# Altium schematic sheet STSPIN32F0A-bldc-driver.SchDoc: STSPIN32F0A-BLDC-Driver-Sch
size A3; DocumentNumber: 3; SheetNumber: 3; SheetTotal: 8
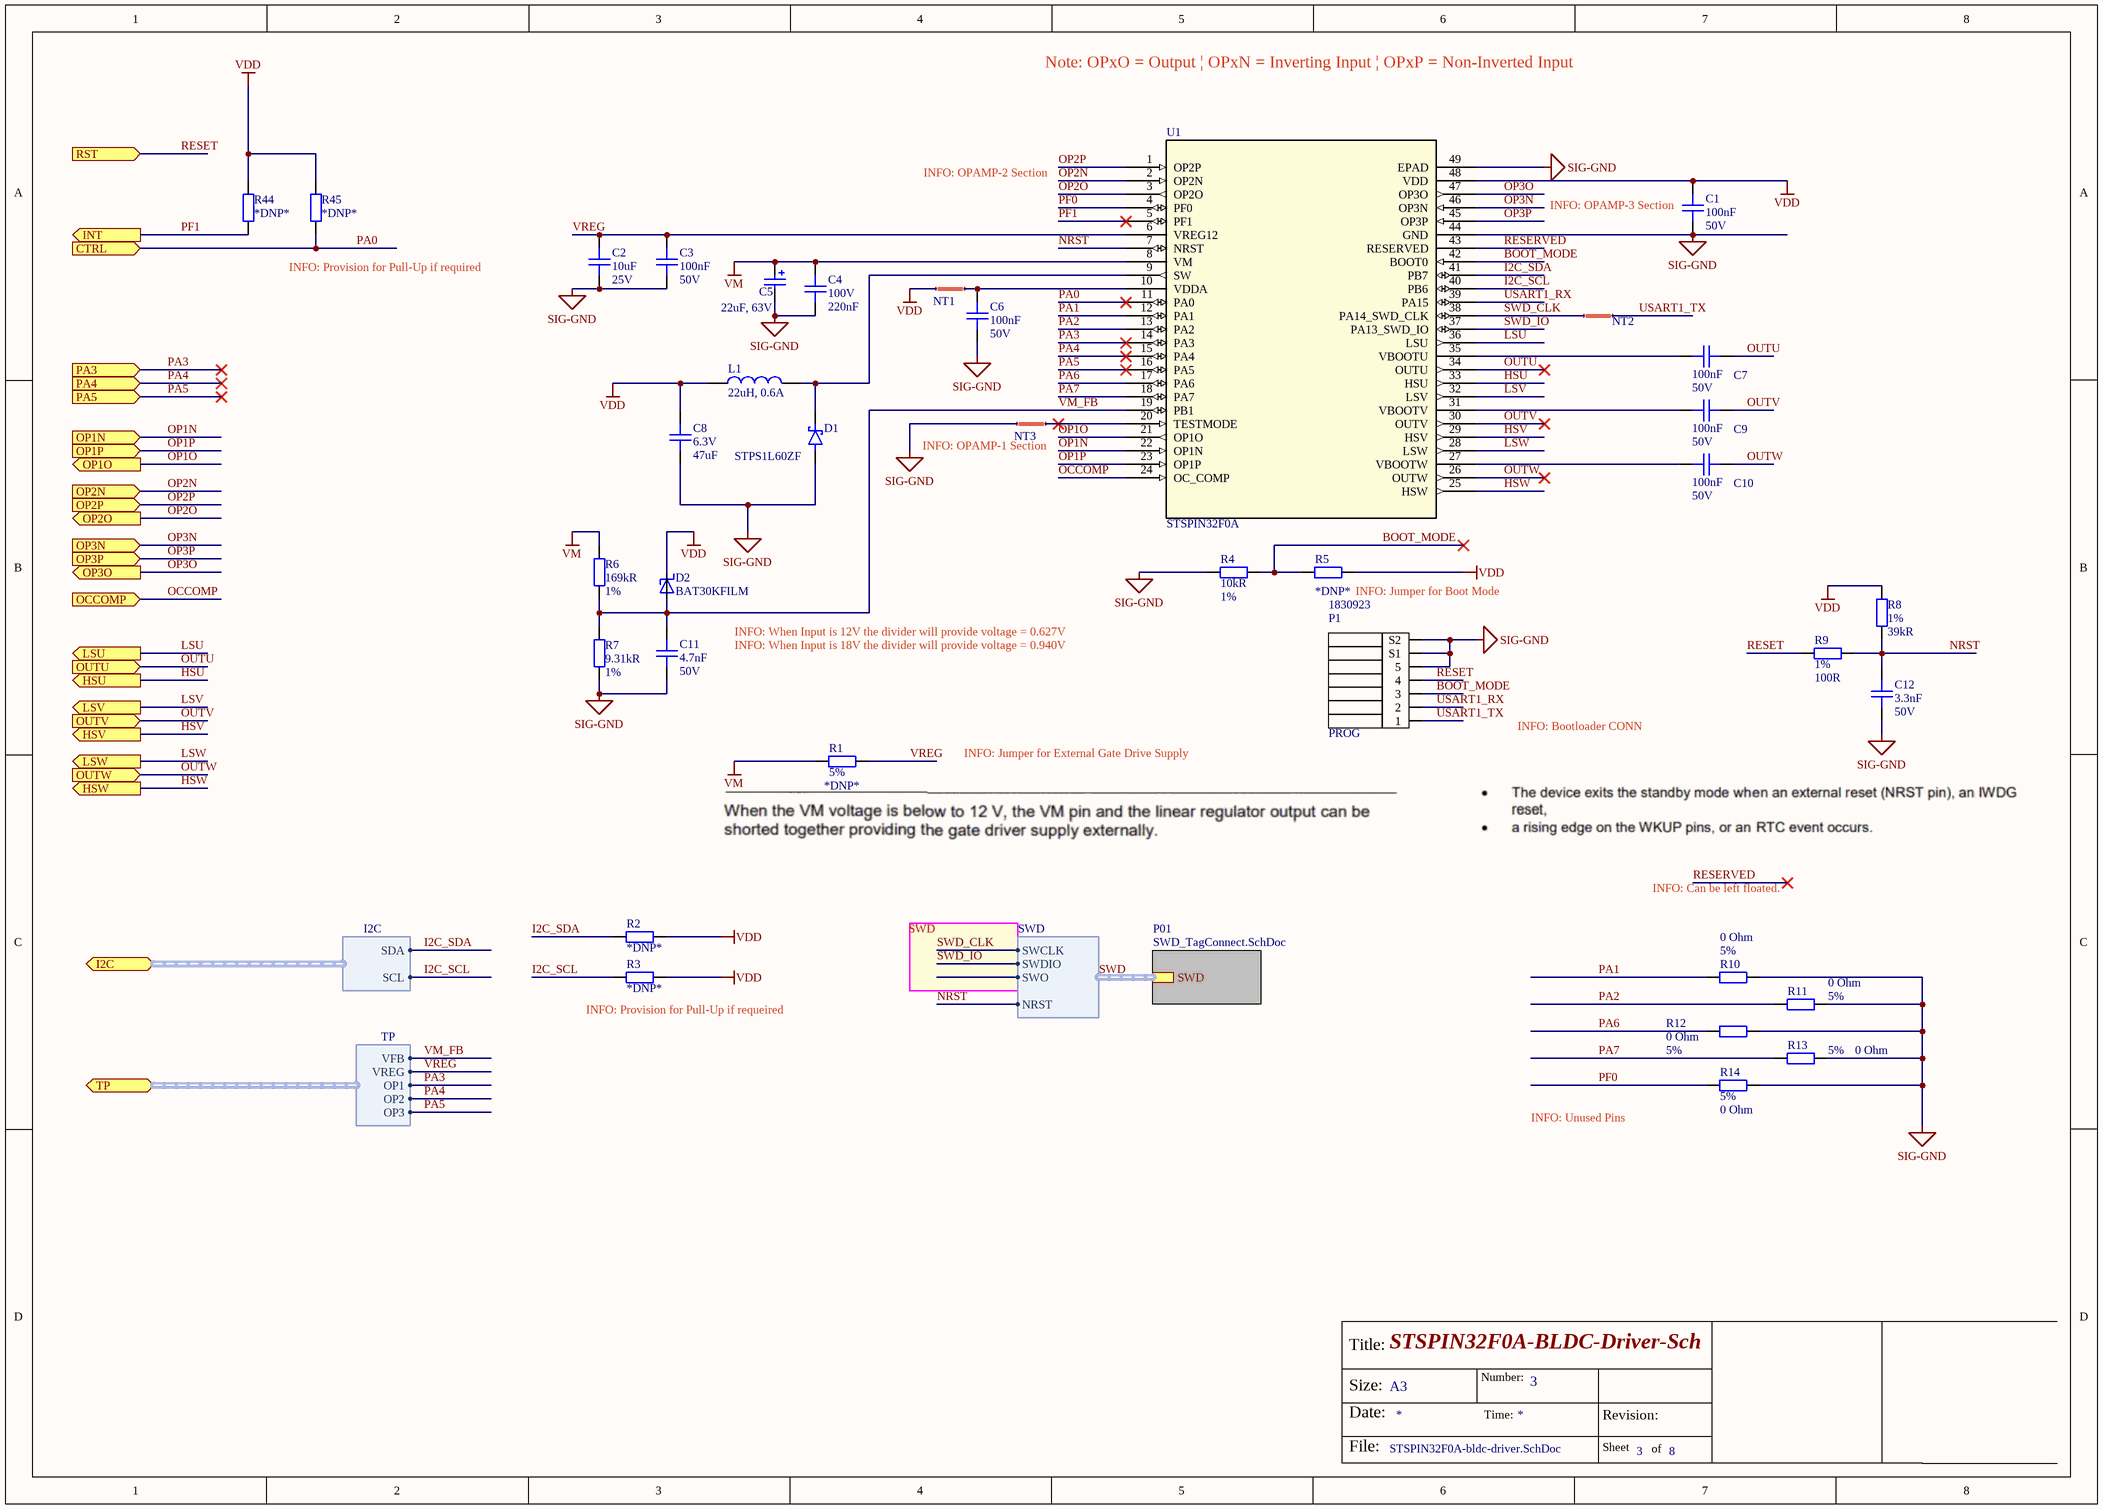
[diagram p0: STSPIN32F0A-bldc-driver.SchDoc]

## Parts
C1  Capacitance: 100nF  Voltage: 50V  [C0402]  (hidden comment: CAP CER 0.1UF 50V X7R 0402)
C2  Capacitance: 10uF  Voltage Rating: 25V  [C1206]  (hidden comment: CAP CER 10UF 25V X7R 1206)
C3  Capacitance: 100nF  Voltage: 50V  [C0402]  (hidden comment: CAP CER 0.1UF 50V X7R 0402)
C4  Voltage Rating: 100V  Capacitance: 220nF  [C0805]  (hidden comment: CAP CER 220nF 100V X7R 0805)
C5  22uF, 63V  [WCAP-ASLL_D6.3H7.7]
C6  Capacitance: 100nF  Voltage: 50V  [C0402]  (hidden comment: CAP CER 0.1UF 50V X7R 0402)
C7  Capacitance: 100nF  Voltage: 50V  [C0402]  (hidden comment: CAP CER 0.1UF 50V X7R 0402)
C8  Voltage Rating: 6.3V  Capacitance: 47uF  [C0603]  (hidden comment: CAP CER 47UF 6.3V X5R 0603)
C9  Capacitance: 100nF  Voltage: 50V  [C0402]  (hidden comment: CAP CER 0.1UF 50V X7R 0402)
C10  Capacitance: 100nF  Voltage: 50V  [C0402]  (hidden comment: CAP CER 0.1UF 50V X7R 0402)
C11  Capacitance: 4.7nF  Voltage Rating: 50V  [C0402]  (hidden comment: CAP CER 4.7nF 50V X7R 0402)
C12  Capacitance: 3.3nF  Voltage: 50V  [C0402]  (hidden comment: CAP CER 0.1UF 50V X7R 0402)
D1  STPS1L60ZF  [DIO_STPS1L60ZF]
D2  BAT30KFILM  [SOD523]
L1  22uH, 0.6A  [WE-LQS_3015]
NT1  Net Tie  [Net Tie 6x30mil]  (value not drawn)  (net tie, no BOM)
NT2  Net Tie  [Net Tie 6x30mil]  (value not drawn)  (net tie, no BOM)
NT3  Net Tie  [Net Tie 6x30mil]  (value not drawn)  (net tie, no BOM)
P1  PROG  Supplier Part Number 1: 1830923  [JST_S5B-ZR-SM4A-TF(LF)(SN)]
R1  *DNP*  Tolerance: 5%  [R0402]
R2  Resistance: *DNP*  [R0402]  (hidden comment: RES SMD 4.75K OHM 1% 1/16W 0402)
R3  Resistance: *DNP*  [R0402]  (hidden comment: RES SMD 4.75K OHM 1% 1/16W 0402)
R4  Resistance: 10kR  Tolerance: 1%  [R0402]  (hidden comment: RES SMD 10K OHM 1% 1/16W 0402)
R5  *DNP*  [R0402]
R6  Resistance: 169kR  Tolerance: 1%  [R0603]  (hidden comment: RES SMD 169 KOHM 1% 1/8W 0603)
R7  Resistance: 9.31kR  Tolerance: 1%  [R0603]  (hidden comment: RES SMD 9.31 KOHM 1% 1/8W 0603)
R8  Tolerance: 1%  Resistance: 39kR  [R0402]  (hidden comment: RES SMD 39K OHM 1% 1/10W 0402)
R9  Tolerance: 1%  Resistance: 100R  [R0402]  (hidden comment: RES SMD 100 OHM 1% 1/16W 0402)
R10  Tolerance: 5%  Resistance: 0 Ohm  [R0402]  (hidden comment: RES SMD 0 OHM JUMPER 1/16W 0402)
R11  Tolerance: 5%  Resistance: 0 Ohm  [R0402]  (hidden comment: RES SMD 0 OHM JUMPER 1/16W 0402)
R12  Tolerance: 5%  Resistance: 0 Ohm  [R0402]  (hidden comment: RES SMD 0 OHM JUMPER 1/16W 0402)
R13  Tolerance: 5%  Resistance: 0 Ohm  [R0402]  (hidden comment: RES SMD 0 OHM JUMPER 1/16W 0402)
R14  Tolerance: 5%  Resistance: 0 Ohm  [R0402]  (hidden comment: RES SMD 0 OHM JUMPER 1/16W 0402)
R44  *DNP*  [R0402]
R45  *DNP*  [R0402]
U1  STSPIN32F0A  [VFQFPN-48_7x7x1mm_STM]

## Sub-sheets
P01 = SWD_TagConnect.SchDoc: SWD (harness SWD)  | Caption: SWD

## Ports
CTRL (in), HSU (out), HSV (out), HSW (out), I2C (bidir, harness I2C), INT (out), LSU (out), LSV (out), LSW (out), OCCOMP (in), OP1N (in), OP1O (out), OP1P (in), OP2N (in), OP2O (out), OP2P (in), OP3N (in), OP3O (out), OP3P (in), OUTU (in), OUTV (in), OUTW (in), PA3 (in), PA4 (in), PA5 (in), RST (in), TP (bidir, harness TP)

## Harnesses
SWD: SWDIO, SWCLK, NRST, SWO
I2C: SDA, SCL
TP: VFB, VREG, OP1, OP2, OP3

## Nets
SIG-GND: C1.1 C2.1 C3.1 C4.1 C5.2(N) C6.1 C8.1 C11.1 C12.1 D1.2(A) NT3.1 P1.5 P1.S1 P1.S2 R4.2 R7.1 R10.2 R11.2 R12.2 R13.2 R14.2 U1.44(GND) U1.49(EPAD)
VDD: C1.2 C8.2 D2.1(K) L1.1 NT1.1 R2.2 R3.2 R5.2 R8.2 R44.2 R45.2 U1.48(VDD)
VM: C4.2 C5.1(P) R1.1 R6.2 U1.8(VM)
BOOT_MODE: P1.3 R4.1 R5.1 U1.42(BOOT0)
HSU: U1.33(HSU) ; port HSU
HSV: U1.29(HSV) ; port HSV
HSW: U1.25(HSW) ; port HSW
I2C_SCL: R3.1 U1.40(PB6) ; port I2C.SCL
I2C_SDA: R2.1 U1.41(PB7) ; port I2C.SDA
LSU: U1.36(LSU) ; port LSU
LSV: U1.32(LSV) ; port LSV
LSW: U1.28(LSW) ; port LSW
NRST: C12.2 R8.1 R9.1 U1.7(NRST) ; sheet P01/SWD.NRST
OCCOMP: U1.24(OC_COMP) ; port OCCOMP
OP1N: U1.22(OP1N) ; port OP1N
OP1O: U1.21(OP1O) ; port OP1O
OP1P: U1.23(OP1P) ; port OP1P
OP2N: U1.2(OP2N) ; port OP2N
OP2O: U1.3(OP2O) ; port OP2O
OP2P: U1.1(OP2P) ; port OP2P
OP3N: U1.46(OP3N) ; port OP3N
OP3O: U1.47(OP3O) ; port OP3O
OP3P: U1.45(OP3P) ; port OP3P
OUTU: C7.2 U1.34(OUTU) ; port OUTU
OUTV: C9.1 U1.30(OUTV) ; port OUTV
OUTW: C10.1 U1.26(OUTW) ; port OUTW
PA0: R45.1 U1.11(PA0) ; port CTRL
PA1: R10.1 U1.12(PA1)
PA2: R11.1 U1.13(PA2)
PA3: U1.14(PA3) ; port PA3, port TP.OP1
PA4: U1.15(PA4) ; port PA4, port TP.OP2
PA5: U1.16(PA5) ; port PA5, port TP.OP3
PA6: R12.1 U1.17(PA6)
PA7: R13.1 U1.18(PA7)
PF0: R14.1 U1.4(PF0)
PF1: R44.1 U1.5(PF1) ; port INT
RESERVED: U1.43(RESERVED)
RESET: P1.4 R9.2 ; port RST
SWD_CLK: NT2.1 U1.38(PA14_SWD_CLK) ; sheet P01/SWD.SWCLK  [project net SWD.SWCLK]
SWD_IO: U1.37(PA13_SWD_IO) ; sheet P01/SWD.SWDIO  [project net SWD.SWDIO]
USART1_RX: P1.2 U1.39(PA15)
USART1_TX: NT2.2 P1.1
VM_FB: C11.2 D2.2(A) R6.1 R7.2 U1.19(PB1) ; port TP.VFB
VREG: C2.2 C3.2 R1.2 U1.6(VREG12) ; port TP.VREG
NetC6_2: C6.2 NT1.2 U1.10(VDDA)
NetC7_1: C7.1 U1.35(VBOOTU)
NetC9_2: C9.2 U1.31(VBOOTV)
NetC10_2: C10.2 U1.27(VBOOTW)
NetD1_1: D1.1(K) L1.2 U1.9(SW)
NetNT3_2: NT3.2 U1.20(TESTMODE)

## Buses and harness runs
harness SWD = sheet P01/SWD

## Notes on the sheet
- Note: OPxO = Output | OPxN = Inverting Input | OPxP = Non-Inverted Input
- INFO: OPAMP-2 Section
- (near C1) INFO: OPAMP-3 Section
- INFO: Provision for Pull-Up if required
- (near NT3) INFO: OPAMP-1 Section
- INFO: When Input is 12V the divider will provide voltage = 0.627V
- INFO: When Input is 18V the divider will provide voltage = 0.940V
- (near R5) INFO: Jumper for Boot Mode
- INFO: Jumper for External Gate Drive Supply
- INFO: Bootloader CONN
- INFO: Can be left floated.
- SWD
- (near R3) INFO: Provision for Pull-Up if requeired
- INFO: Unused Pins
- Title:
- Size:
- A3
- Number:
- Date:
- File:
- Time:
- Revision:
- Sheet
- of

## Library data of the parts
C1 C3 C6 C7 C9 C10 = CAP CER 0.1UF 50V X7R 0402: 0.1µF ±10% 50V Ceramic Capacitor X7R 0402 (1005 Metric); Manufacturer: TDK; Manufacturer Part Number: CGA2B3X7R1H104K050BB; Supplier 1: Digi-Key; Stock 1: 2925303; Pricing 1: 1=0.17, 10=0.118, 50=0.0668, 100=0.0553, 500=0.0388, 1000=0.0321, 2500=0.0299, 5000=0.0273 (USD); Mount: Surface Mount; Case/Package: 0402; Weight: 2.3E-05oz; Case Code (Metric): 1005; Case Code (Imperial): 0402; Min Operating Temperature: -55°C; Max Operating Temperature: 125°C; Voltage Rating: 50V; Tolerance: 10%; Packaging: Tape and Reel; Package Quantity: 1; Voltage Rating (DC): 50V; Dielectric: X7R; Termination: SMD/SMT; Composition: Ceramic; Length: 1mm; Height: 0.5mm; Width: 0.02inch; Thickness: 0.022inch; Depth: 0.5mm; Ratings: AEC-Q200; REACH SVHC: No SVHC; Lead Free: Lead Free; ComponentLink1URL: http://product.tdk.com/capacitor/mlcc/en/documents/mlccspec_automotive_general_midvoltage_en.pdf?src-supplier=Future+Electronics; ComponentLink1Description: http://product.tdk.com/capacitor/mlcc/en/documents/mlccspec_automotive_general_midvoltage_en.pdf?src-supplier=Future+Electronics; ComponentLink2URL: http://www.farnell.com/datasheets/1807242.pdf?src-supplier=Element14; ComponentLink2Description: http://www.farnell.com/datasheets/1807242.pdf?src-supplier=Element14; ComponentLink3URL: http://www.mouser.com/ds/2/400/lcc_automotive_general_en-843974.pdf?src-supplier=Mouser; ComponentLink3Description: http://www.mouser.com/ds/2/400/lcc_automotive_general_en-843974.pdf?src-supplier=Mouser; ComponentLink4URL: http://www.farnell.com/datasheets/1936565.pdf?src-supplier=Element14; ComponentLink4Description: http://www.farnell.com/datasheets/1936565.pdf?src-supplier=Element14; ComponentLink5URL: http://www.farnell.com/datasheets/1735392.pdf?src-supplier=Element14; ComponentLink5Description: http://www.farnell.com/datasheets/1735392.pdf?src-supplier=Element14; Supplier Part Number 1: 445-6899-1-ND
C2 = CAP CER 10UF 25V X7R 1206: 10µF ±10% 25V Ceramic Capacitor X7R 1206 (3216 Metric); Manufacturer: Yageo; Manufacturer Part Number: CC1206KKX7R8BB106; Supplier 1: Digi-Key; Stock 1: 3990; Pricing 1: 1=0.49, 10=0.348, 50=0.2632, 100=0.2293, 500=0.1698, 1000=0.1444 (USD); Mount: Surface Mount; Case/Package: 1206; Weight: 0.000571oz; Case Code (Imperial): 1206; Case Code (Metric): 3216; Min Operating Temperature: -55°C; Max Operating Temperature: 125°C; Tolerance: 10%; Packaging: Tape and Reel; Voltage Rating (DC): 25V; Dielectric: X7R; Termination: SMD/SMT; Composition: Ceramic; Length: 3.2mm; Width: 1.6mm; Thickness: 0.071inch; Depth: 1.6mm; Radiation Hardening: No; Lead Free: Lead Free; Halogen Free: Halogen Free; ComponentLink1URL: http://www.yageo.com/documents/recent/UPY-GPHC_X7R_6.3V-to-50V_8.pdf?src-supplier=Avnet; ComponentLink1Description: http://www.yageo.com/documents/recent/UPY-GPHC_X7R_6.3V-to-50V_8.pdf?src-supplier=Avnet; ComponentLink2URL: http://www.mouser.com/ds/2/447/Yageo_UPY-GP_NP0_16V-to-50V_9-358835.pdf?src-supplier=Mouser; ComponentLink2Description: http://www.mouser.com/ds/2/447/Yageo_UPY-GP_NP0_16V-to-50V_9-358835.pdf?src-supplier=Mouser; ComponentLink3URL: http://components.arrow.com/part/dataview/0323_04166677?src-supplier=Arrow+Europe; ComponentLink3Description: http://components.arrow.com/part/dataview/0323_04166677?src-supplier=Arrow+Europe; ComponentLink4URL: http://www.yageo.com/documents/recent/UPY-GPHC_X7R_6.3V-to-50V_18.pdf?src-supplier=Digi-Key; ComponentLink4Description: http://www.yageo.com/documents/recent/UPY-GPHC_X7R_6.3V-to-50V_18.pdf?src-supplier=Digi-Key; ComponentLink5URL: http://www.yageo.com/documents/recent/UPY-GPHC_X7R_6.3V-to-50V_9.pdf?src-supplier=Future+Electronics; ComponentLink5Description: http://www.yageo.com/documents/recent/UPY-GPHC_X7R_6.3V-to-50V_9.pdf?src-supplier=Future+Electronics; Supplier Part Number 1: 311-1959-1-ND
C4 = CAP CER 22UF 10V X5R 0805: 220nF ±10% 100V Ceramic Capacitor X7R 0805 (2012 Metric); Manufacturer: KEMET; Manufacturer Part Number: C0805C224K1RECAUTO; Stock 1: 1006805; Pricing 1: 1=0.45, 10=0.312, 100=0.1875, 500=0.1406, 1000=0.1187 (USD); Mount: Surface Mount; Number of Pins: 2; Case Code (Metric): 2012; Case Code (Imperial): 0805; Min Operating Temperature: -55°C; Max Operating Temperature: 85°C; Packaging: Tape and Reel; Tolerance: 10%; Voltage Rating (DC): 100V; Dielectric: X7R; Termination: SMD/SMT; Package Quantity: 1; Composition: Ceramic; Length: 2mm; Height: 1.25mm; Width: 0.049inch; Thickness: 0.053inch; Depth: 1.25mm; Radiation Hardening: No; REACH SVHC: Unknown; Case/Package: 0805; Datasheet: https://content.kemet.com/datasheets/KEM_C1090_X7R_ESD.pdf; Supplier 1: Digi-Key; Supplier Part Number 1: 399-17890-1-ND
C5 = 865060745003: WCAP-ASLL Aluminum Electrolytic Capacitor, V-Chip, SMT, D6.3xH7.7mm, 22uF, 63V; Manufacturer: Wurth Elektronik; Technical Reference: ASED077220M063DVCTCB000; Ripple Current: 120mA; Capacitance Tolerance: +/-20%; Rated Voltage: 63VDC; Dissipation Factor: 10%; Endurance: 2000h; Leakage Current: 13.86uA; Operating Temperature: -55 to +105degC; Mounting Technology: SMT; ComponentLink1URL: http://www.we-online.de; ComponentLink1Description: Manufacturer; Packaging: Tape and Reel; Published Date: October 2020; Manufacturer Part Number: 865060745003; ComponentLink2Description: Datasheet; ComponentLink2URL: https://www.we-online.com/catalog/datasheet/865060745003.pdf; Diameter: 6.3mm; Capacitance: 22uF; Height: 7.7mm; Supplier 1: Newark; Supplier Part Number 1: 48AC8368
C8 = CAP CER 4.7UF 16V X5R 0603: 47µF ±20% 6.3V Ceramic Capacitor X5R 0603 (1608 Metric); Manufacturer: AVX Corporation; Manufacturer Part Number: 06036D476MAT2A; Stock 1: 332229; Pricing 1: 1=0.5, 10=0.355, 50=0.2688, 100=0.2341 (USD); Mount: Surface Mount; Case/Package: 0603; Weight: 7.1E-05oz; Case Code (Metric): 1608; Case Code (Imperial): 0603; Min Operating Temperature: -55°C; Max Operating Temperature: 85°C; Tolerance: 20%; Packaging: Tape and Reel; Voltage Rating (DC): 6.3V; Dielectric: X5R; Termination: SMD/SMT; Length: 1.6mm; Height: 0.8mm; Width: 0.8mm; Thickness: 0.037inch; Depth: 0.8mm; Lead Free: Lead Free; ComponentLink1URL: http://www.mouser.com/ds/2/447/UPY-GPHC_X5R_4V-to-50V_25-1131599.pdf?src-supplier=Mouser; ComponentLink1Description: http://www.mouser.com/ds/2/447/UPY-GPHC_X5R_4V-to-50V_25-1131599.pdf?src-supplier=Mouser; ComponentLink2URL: http://www.yageo.com/documents/recent/UPY-GPHC_X5R_4V-to-50V_25.pdf?src-supplier=Digi-Key; ComponentLink2Description: http://www.yageo.com/documents/recent/UPY-GPHC_X5R_4V-to-50V_25.pdf?src-supplier=Digi-Key; ComponentLink3URL: http://components.arrow.com/part/dataview/0323_04166500?src-supplier=Arrow+Europe; ComponentLink3Description: http://components.arrow.com/part/dataview/0323_04166500?src-supplier=Arrow+Europe; Composition: Ceramic; Halogen Free: Halogen Free; Supplier 1: Digi-Key; Supplier Part Number 1: 478-11180-1-ND
C11 = CAP CER 0.047UF 50V X7R 0402: 4.7nF ±10% 50V Ceramic Capacitor X7R 0402 (1005 Metric); Manufacturer: KEMET; Manufacturer Part Number: C0402C472K5RECAUTO; Stock 1: 1255429; Pricing 1: 1=0.11, 10=0.083, 50=0.045, 100=0.0368, 500=0.0263, 1000=0.0207, 2500=0.0188, 5000=0.0173 (USD); Mount: Surface Mount; Case/Package: 0402; Weight: 2.3E-05oz; Case Code (Metric): 1005; Case Code (Imperial): 0402; Min Operating Temperature: -55°C; Max Operating Temperature: 125°C; Tolerance: 10%; Dielectric: X7R; Voltage Rating (DC): 50V; Packaging: Tape and Reel; Termination: SMD/SMT; Package Quantity: 1; Composition: Ceramic; Length: 1mm; Height: 0.5mm; Width: 0.02inch; Thickness: 0.022inch; Depth: 0.5mm; Ratings: AEC-Q200; Radiation Hardening: No; Lead Free: Lead Free; REACH SVHC: No SVHC; Datasheet: https://content.kemet.com/datasheets/KEM_C1090_X7R_ESD.pdf; Supplier 1: Digi-Key; Supplier Part Number 1: 399-C0402C472K5RECAUTOCT-ND
C12 = CAP CER 0.1UF 50V X7R 0402: 0.1µF ±10% 50V Ceramic Capacitor X7R 0402 (1005 Metric); Manufacturer: KEMET; Manufacturer Part Number: C0402C332K5RECAUTO; Stock 1: 2925303; Pricing 1: 1=0.17, 10=0.118, 50=0.0668, 100=0.0553, 500=0.0388, 1000=0.0321, 2500=0.0299, 5000=0.0273 (USD); Mount: Surface Mount; Case/Package: 0402; Weight: 2.3E-05oz; Case Code (Metric): 1005; Case Code (Imperial): 0402; Min Operating Temperature: -55°C; Max Operating Temperature: 125°C; Voltage Rating: 50V; Tolerance: 10%; Packaging: Tape and Reel; Package Quantity: 1; Voltage Rating (DC): 50V; Dielectric: X7R; Termination: SMD/SMT; Composition: Ceramic; Length: 1mm; Height: 0.5mm; Width: 0.02inch; Thickness: 0.022inch; Depth: 0.5mm; Ratings: AEC-Q200; REACH SVHC: No SVHC; Lead Free: Lead Free; Datasheet: https://content.kemet.com/datasheets/KEM_C1090_X7R_ESD.pdf; Supplier 1: Digi-Key; Supplier Part Number 1: 399-C0402C332K5RECAUTOCT-ND
D1 = STPS1L60ZF: Diode Schottky 60V 1A Surface Mount SOD-123F; Manufacturer: STMicroelectronics; Package: SOD-123F; Supplier 1: Digi-Key; Supplier Part Number 1: 497-17154-1-ND; Manufacturer Part Number: STPS1L60ZF; Datasheet: https://www.st.com/content/ccc/resource/technical/document/datasheet/group1/7e/b6/29/85/66/15/45/f3/CD00002285/files/CD00002285.pdf/jcr:content/translations/en.CD00002285.pdf
D2 = BAT30KFILM: Schottky Diode 30V 300mA (DC) Surface Mount SOD-523; Manufacturer: STMicroelectronics; Manufacturer Part Number: BAT30KFILM; Package: SOD-523; Supplier 1: Digi-Key; Supplier Part Number 1: 497-5552-1-ND; Value: BAT30KFILM; ComponentLink1Description: Datasheet; ComponentLink1URL: http://www.farnell.com/datasheets/2307448.pdf
L1 = 74404032220: WE-LQS SMT Power Inductor, size 3015, 22uH, 0.6A; Manufacturer: Wurth Elektronik; Self Resonant Frequency: 19MHz; DC Resistance: 450mOhm; ComponentLink1Description: Manufacturer; ComponentLink1URL: http://www.we-online.de; ComponentLink2Description: Datasheet; ComponentLink2URL: https://www.we-online.com/catalog/datasheet/74404032220.pdf; Published Date: March 2020; Rated Current: 0.6A; Saturation Current: 0.6A; Operating Temperature: -40 to +125degC; Mounting Technology: SMT; Packaging: Tape and Reel; Manufacturer Part Number: 74404032220; Inductance: 22uH; Size: 3015; Supplier 1: Digi-Key; Supplier Part Number 1: 732-5499-1-ND
NT1-NT3 = Net Tie Line: ClassName: STM32G473CETx
P1 = JST_S5B-ZR-SM4A-TF(LF)(SN): Connector Header SMD, Right Angle 4 position 0.059" (1.50mm); Manufacturer: JST; Manufacturer Part Number: S4B-ZR-SM4A-TF; Body Plating: Tin; Number of Positions: 4; Connector Type: Header,Male Pin; Voltage Rating: 50V; Contact Resistance: 30mR; Max Current Rating: 1A; Insulation Resistance: 500MR; Gender: Male; Pitch: 1.5mm; Panel Thickness: 3.5mm; Stock 1: 0; Mount: Surface Mount; Number of Pins: 4; Color: White; Contact Plating: Tin,Copper; Contact Material: Brass,Tin,Copper; Material: Nylon; Housing Color: Beige; Housing Material: Polyamide; Contact Shape: Circular; Insulation Material: Nylon; Insulation Color: Natural; Min Operating Temperature: -25°C; Max Operating Temperature: 85°C; Packaging: Bulk; Number of Rows: 1; Termination: Solder; Voltage Rating (DC): 50V; Current Rating: 1A; Voltage Rating (AC): 50V; Fastening Type: Detent; Max Voltage Rating (AC): 50V; Max Voltage Rating (DC): 50V; Number of Contacts: 4; Orientation: Right Angle; Length: 7.5mm; Height: 7.2mm; Width: 3.5mm; Depth: 6mm; Lead Pitch: 1.5mm; Contact Mating Length: 0.094inch; REACH SVHC: No SVHC; Lead Free: Lead Free; Flammability Rating: UL94 V-0; ComponentLink1URL: https://www.jst-mfg.com/product/pdf/eng/eZH.pdf; ComponentLink1Description: Datasheet; Supplier 1: Farnell
R1 R10-R14 = RES SMD 0 OHM JUMPER 1/16W 0402: 0 Ohms Jumper 0.063W, 1/16W Chip Resistor 0402 (1005 Metric) Moisture Resistant Thick Film; Manufacturer: Yageo; Manufacturer Part Number: RC0402JR-070RL; Power Rating: 62.5mW; Voltage Rating: 50V; Max Power Dissipation: 63mW; Temperature Coefficient: 200ppm/°C; Supplier 1: Digi-Key; Stock 1: 46057148; Pricing 1: 1=0.1, 10=0.013, 25=0.0092, 50=0.0072, 100=0.0053, 250=0.004, 500=0.0032, 1000=0.0024, 5000=0.0017 (USD); Contact Plating: Tin,Matte; Case Code (Metric): 1005; Case Code (Imperial): 0402; Min Operating Temperature: -55°C; Max Operating Temperature: 155°C; Packaging: Tape and Reel; Composition: Thick Film; Package Quantity: 1; Number of Terminations: 2; Termination: SMD/SMT; Military Standard: Not; Features: Moisture Resistant; Length: 1mm; Height: 0.016inch; Width: 0.02inch; Depth: 0.5mm; Radiation Hardening: No; REACH SVHC: Unknown; Lead Free: Lead Free; ComponentLink1URL: http://www.yageo.com/documents/recent/PYu-RC_Group_51_RoHS_L_10.pdf?src-supplier=Digi-Key; ComponentLink1Description: http://www.yageo.com/documents/recent/PYu-RC_Group_51_RoHS_L_10.pdf?src-supplier=Digi-Key; ComponentLink2URL: http://www.yageo.com/documents/recent/PYu-RC0402_51_RoHS_L_6.pdf?src-supplier=Avnet+Europe; ComponentLink2Description: http://www.yageo.com/documents/recent/PYu-RC0402_51_RoHS_L_6.pdf?src-supplier=Avnet+Europe; ComponentLink3URL: http://www.farnell.com/datasheets/1018594.pdf?src-supplier=Element14; ComponentLink3Description: http://www.farnell.com/datasheets/1018594.pdf?src-supplier=Element14; ComponentLink4URL: https://www.verical.com/server-webapp/html/getDatasheet?partID=326379&src-supplier=Verical; ComponentLink4Description: https://www.verical.com/server-webapp/html/getDatasheet?partID=326379&src-supplier=Verical; ComponentLink5URL: http://www.farnell.com/datasheets/2167052.pdf?src-supplier=Element14; ComponentLink5Description: http://www.farnell.com/datasheets/2167052.pdf?src-supplier=Element14; Supplier Part Number 1: 311-0.0JRCT-ND; Case/Package: 0402; ClassName: USB_SW; Mount: Surface Mount
R2 R3 = RES SMD 4.75K OHM 1% 1/16W 0402: 4.75 kOhms ±1% 0.063W, 1/16W Chip Resistor 0402 (1005 Metric) Moisture Resistant Thick Film; Manufacturer: Yageo; Manufacturer Part Number: RC0402FR-074K75P; Max Power Dissipation: 63mW; Temperature Coefficient: 150ppm/°C; Case/Package: 0402; Supplier 1: Digi-Key; Stock 1: 23485; Pricing 1: 1=0.1, 10=0.035, 100=0.014, 1000=0.0063, 2500=0.0055, 5000=0.0045 (USD); Case Code (Metric): 1005; Case Code (Imperial): 0402; Min Operating Temperature: -55°C; Max Operating Temperature: 155°C; Packaging: Tape and Reel; Composition: Thick Film; Number of Terminations: 2; Features: Moisture Resistant; Length: 0.039inch; Height: 0.016inch; Width: 0.02inch; ComponentLink1URL: http://www.yageo.com/NewPortal/yageodocoutput?fileName=/pdf/R-Chip/PYu-RC_51_RoHS_P_0.pdf&src-supplier=Digi-Key; ComponentLink1Description: http://www.yageo.com/NewPortal/yageodocoutput?fileName=/pdf/R-Chip/PYu-RC_51_RoHS_P_0.pdf&src-supplier=Digi-Key; ComponentLink2URL: http://www.yageo.com.tw/exep/pages/download/literatures/PYu-R_INT-thick_7.pdf?src-supplier=Digi-Key; ComponentLink2Description: http://www.yageo.com.tw/exep/pages/download/literatures/PYu-R_INT-thick_7.pdf?src-supplier=Digi-Key; Supplier Part Number 1: YAG1271CT-ND; Tolerance: 1%; ClassName: I2C_SW; Mount: Surface Mount
R4 = RES SMD 10K OHM 1% 1/16W 0402: 10 kOhms ±1% 0.063W, 1/16W Chip Resistor 0402 (1005 Metric) Moisture Resistant Thick Film; Manufacturer: Yageo; Manufacturer Part Number: RC0402FR-0710KP; Max Power Dissipation: 63mW; Temperature Coefficient: 150ppm/°C; Supplier 1: Digi-Key; Stock 1: 839368; Pricing 1: 1=0.1, 10=0.035, 100=0.014, 1000=0.0063, 2500=0.0055, 5000=0.0045 (USD); Case/Package: 0402; Case Code (Metric): 1005; Case Code (Imperial): 0402; Min Operating Temperature: -55°C; Max Operating Temperature: 155°C; Packaging: Tape and Reel; Composition: Thick Film; Number of Terminations: 2; Features: Moisture Resistant; Length: 0.039inch; Height: 0.016inch; Width: 0.02inch; ComponentLink1URL: http://www.yageo.com/NewPortal/yageodocoutput?fileName=/pdf/R-Chip/PYu-RC_51_RoHS_P_0.pdf&src-supplier=Digi-Key; ComponentLink1Description: http://www.yageo.com/NewPortal/yageodocoutput?fileName=/pdf/R-Chip/PYu-RC_51_RoHS_P_0.pdf&src-supplier=Digi-Key; Supplier Part Number 1: YAG1249CT-ND; Mount: Surface Mount
R5 R44 R45 = RES SMD 0 OHM JUMPER 1/16W 0402: 0 Ohms Jumper 0.063W, 1/16W Chip Resistor 0402 (1005 Metric) Moisture Resistant Thick Film; Manufacturer: Yageo; Manufacturer Part Number: RC0402JR-070RL; Power Rating: 62.5mW; Voltage Rating: 50V; Max Power Dissipation: 63mW; Temperature Coefficient: 200ppm/°C; Tolerance: 5%; Supplier 1: Digi-Key; Stock 1: 46057148; Pricing 1: 1=0.1, 10=0.013, 25=0.0092, 50=0.0072, 100=0.0053, 250=0.004, 500=0.0032, 1000=0.0024, 5000=0.0017 (USD); Contact Plating: Tin,Matte; Case Code (Metric): 1005; Case Code (Imperial): 0402; Min Operating Temperature: -55°C; Max Operating Temperature: 155°C; Packaging: Tape and Reel; Composition: Thick Film; Package Quantity: 1; Number of Terminations: 2; Termination: SMD/SMT; Military Standard: Not; Features: Moisture Resistant; Length: 1mm; Height: 0.016inch; Width: 0.02inch; Depth: 0.5mm; Radiation Hardening: No; REACH SVHC: Unknown; Lead Free: Lead Free; ComponentLink1URL: http://www.yageo.com/documents/recent/PYu-RC_Group_51_RoHS_L_10.pdf?src-supplier=Digi-Key; ComponentLink1Description: http://www.yageo.com/documents/recent/PYu-RC_Group_51_RoHS_L_10.pdf?src-supplier=Digi-Key; ComponentLink2URL: http://www.yageo.com/documents/recent/PYu-RC0402_51_RoHS_L_6.pdf?src-supplier=Avnet+Europe; ComponentLink2Description: http://www.yageo.com/documents/recent/PYu-RC0402_51_RoHS_L_6.pdf?src-supplier=Avnet+Europe; ComponentLink3URL: http://www.farnell.com/datasheets/1018594.pdf?src-supplier=Element14; ComponentLink3Description: http://www.farnell.com/datasheets/1018594.pdf?src-supplier=Element14; ComponentLink4URL: https://www.verical.com/server-webapp/html/getDatasheet?partID=326379&src-supplier=Verical; ComponentLink4Description: https://www.verical.com/server-webapp/html/getDatasheet?partID=326379&src-supplier=Verical; ComponentLink5URL: http://www.farnell.com/datasheets/2167052.pdf?src-supplier=Element14; ComponentLink5Description: http://www.farnell.com/datasheets/2167052.pdf?src-supplier=Element14; Supplier Part Number 1: 311-0.0JRCT-ND; Case/Package: 0402; ClassName: USB_SW; Mount: Surface Mount
R6 = RES SMD 2.26 OHM 1% 1/10W 0603: 169 kOhms ±1% 0.125W, 1/8W Chip Resistor 0603 (1608 Metric) Automotive AEC-Q200 Thick Film; Manufacturer Part Number: TNPW0603169KBEEA; Manufacturer: Vishay Dale; Temperature Coefficient: 100ppm/°C; Voltage Rating: 75V; Power Rating: 125mW; Stock 1: 18141; Pricing 1: 1=0.1, 10=0.04, 100=0.0164, 1000=0.0074, 2500=0.0064 (USD); Case Code (Imperial): 0603; Case Code (Metric): 1608; Min Operating Temperature: -55°C; Max Operating Temperature: 155°C; Composition: Thick Film; Packaging: Tape and Reel; Termination: SMD/SMT; Military Standard: Not; Number of Terminations: 2; Length: 1.55mm; Height: 0.02inch; Width: 0.85mm; Depth: 0.85mm; Lead Free: Lead Free; Case/Package: 0603; Weight: 7.1E-05oz; Contact Plating: Tin; Package Quantity: 5000; Max Power Dissipation: 125mW; Features: Automotive AEC-Q200; Radiation Hardening: No; Mount: Surface Mount; Supplier 1: Digi-Key; Supplier Part Number 1: 541-4530-1-ND; Datasheet: https://www.vishay.com/docs/28758/tnpw_e3.pdf
R7 = RES SMD 2.26 OHM 1% 1/10W 0603: 9.31 kOhms ±1% 0.125W, 1/8W Chip Resistor 0603 (1608 Metric) Automotive AEC-Q200 Thick Film; Manufacturer Part Number: TNPW06039K31BEEA; Manufacturer: Vishay Dale; Temperature Coefficient: 100ppm/°C; Voltage Rating: 75V; Power Rating: 125mW; Stock 1: 18141; Pricing 1: 1=0.1, 10=0.04, 100=0.0164, 1000=0.0074, 2500=0.0064 (USD); Case Code (Imperial): 0603; Case Code (Metric): 1608; Min Operating Temperature: -55°C; Max Operating Temperature: 155°C; Composition: Thick Film; Packaging: Tape and Reel; Termination: SMD/SMT; Military Standard: Not; Number of Terminations: 2; Length: 1.55mm; Height: 0.02inch; Width: 0.85mm; Depth: 0.85mm; Lead Free: Lead Free; Case/Package: 0603; Weight: 7.1E-05oz; Contact Plating: Tin; Package Quantity: 5000; Max Power Dissipation: 125mW; Features: Automotive AEC-Q200; Radiation Hardening: No; Mount: Surface Mount; Datasheet: https://www.vishay.com/docs/28758/tnpw_e3.pdf; Supplier 1: Digi-Key; Supplier Part Number 1: 541-TNPW06039K31BEEACT-ND
R8 = RES SMD 54.9K OHM 1% 1/16W 0402: 39 kOhms ±1% 0.100W, 1/10W Chip Resistor 0402 (1005 Metric) Moisture Resistant Thick Film; Manufacturer: Panasonic Electronic Components; Manufacturer Part Number: ERJ-2RKF3902X; Power Rating: 100mW; Voltage Rating: 50V; Temperature Coefficient: 100ppm/°C; Stock 1: 707322; Pricing 1: 1=0.1, 10=0.015, 100=0.0062, 1000=0.0028, 2500=0.0024, 5000=0.002 (USD); Case/Package: 0402; Case Code (Imperial): 0402; Case Code (Metric): 1005; Min Operating Temperature: -55°C; Max Operating Temperature: 155°C; Packaging: Tape and Reel; Termination: SMD/SMT; Military Standard: Not; Composition: Thick Film; Length: 1mm; Depth: 0.5mm; Lead Free: Lead Free; Contact Plating: Tin,Matte; Number of Terminations: 2; Max Power Dissipation: 100mW; Voltage Rating (DC): 50V; Features: Moisture Resistant; Height: 0.016inch; Width: 0.02inch; Mount: Surface Mount; Datasheet: https://industrial.panasonic.com/cdbs/www-data/pdf/RDA0000/AOA0000C304.pdf; Supplier 1: Digi-Key; Supplier Part Number 1: P39.0KLCT-ND
R9 = RES SMD 100 OHM 1% 1/16W 0402: 100 Ohms ±1% 0.063W, 1/16W Chip Resistor 0402 (1005 Metric) Moisture Resistant Thick Film; Manufacturer: Yageo; Manufacturer Part Number: RC0402FR-07100RL; Power Rating: 62.5mW; Voltage Rating: 50V; Temperature Coefficient: 100ppm/°C; Supplier 1: Digi-Key; Stock 1: 16989760; Pricing 1: 1=0.1, 10=0.016, 100=0.0064, 1000=0.0029, 2500=0.0025, 5000=0.0021 (USD); Case/Package: 0402; Number of Pins: 2; Case Code (Imperial): 0402; Case Code (Metric): 1005; Min Operating Temperature: -55°C; Max Operating Temperature: 155°C; Voltage Rating (DC): 50V; Packaging: Tape and Reel; Termination: SMD/SMT; Composition: Thick Film; Military Standard: Not; Length: 1mm; Height: 0.32mm; Width: 0.5mm; Depth: 0.5mm; REACH SVHC: No SVHC; Lead Free: Lead Free; ComponentLink1URL: http://www.farnell.com/datasheets/2167052.pdf?src-supplier=Element14; ComponentLink1Description: http://www.farnell.com/datasheets/2167052.pdf?src-supplier=Element14; ComponentLink2URL: http://www.yageo.com/documents/recent/PYu-RC_Group_51_RoHS_L_9.pdf?src-supplier=Mouser; ComponentLink2Description: http://www.yageo.com/documents/recent/PYu-RC_Group_51_RoHS_L_9.pdf?src-supplier=Mouser; ComponentLink3URL: http://www.yageo.com/documents/recent/PYu-RC0402_51_RoHS_L_6_r.pdf?src-supplier=Future+Electronics; ComponentLink3Description: http://www.yageo.com/documents/recent/PYu-RC0402_51_RoHS_L_6_r.pdf?src-supplier=Future+Electronics; ComponentLink4URL: https://www.verical.com/server-webapp/html/getDatasheet?partID=329466&src-supplier=Verical; ComponentLink4Description: https://www.verical.com/server-webapp/html/getDatasheet?partID=329466&src-supplier=Verical; ComponentLink5URL: http://www.farnell.com/datasheets/1018594.pdf?src-supplier=Element14; ComponentLink5Description: http://www.farnell.com/datasheets/1018594.pdf?src-supplier=Element14; ComponentLink6URL: http://documents.rs-components.com/techlib://itc_doclist_GB.htm?stockno=6185810&src-supplier=RSComponents; ComponentLink6Description: http://documents.rs-components.com/techlib://itc_doclist_GB.htm?stockno=6185810&src-supplier=RSComponents; Supplier Part Number 1: 311-100LRDKR-ND; Mount: Surface Mount
U1 = STSPIN32F0A: No Description Available; Manufacturer: STMicroelectronics; Built_By: EMA_Jessica; SourceLibrary: Update_to_database_2020-12-04; EVAL Kit: STEVAL-SPIN3202; Manufacturer Part Number: STSPIN32F0A; Copyright: Copyright (C) 2018 Accelerated Designs. All rights reserved; ComponentLink1Description: Datasheet; ComponentLink1URL: https://www.google.com/url?sa=t&rct=j&q=&esrc=s&source=web&cd=&ved=2ahUKEwjgwpfom8rwAhVUb30KHfxED0oQFjAAegQIBhAD&url=https%3A%2F%2Fwww.st.com%2Fresource%2Fen%2Fdatasheet%2Fstspin32f0a.pdf&usg=AOvVaw3no-3pqo9JeAS3_K3kXbhn; Supplier 1: Newark; Supplier Part Number 1: 43AC0300; ComponentLink2Description: Evaluation Board Schematic; ComponentLink2URL: https://www.st.com/content/ccc/resource/technical/layouts_and_diagrams/schematic_pack/group0/a9/20/bf/a8/9b/aa/43/2b/STEVAL-SPIN3202_schematics/files/steval-spin3202_schematic.pdf/jcr:content/translations/en.steval-spin3202_schematic.pdf